# EasyEDA schematic SCH FC.json
TITLE: Sheet_1; REV: 1.0; Date: 2025-05-10; Sheet: 1/1; Drawn By: upkiratpaul; Company: Your Company
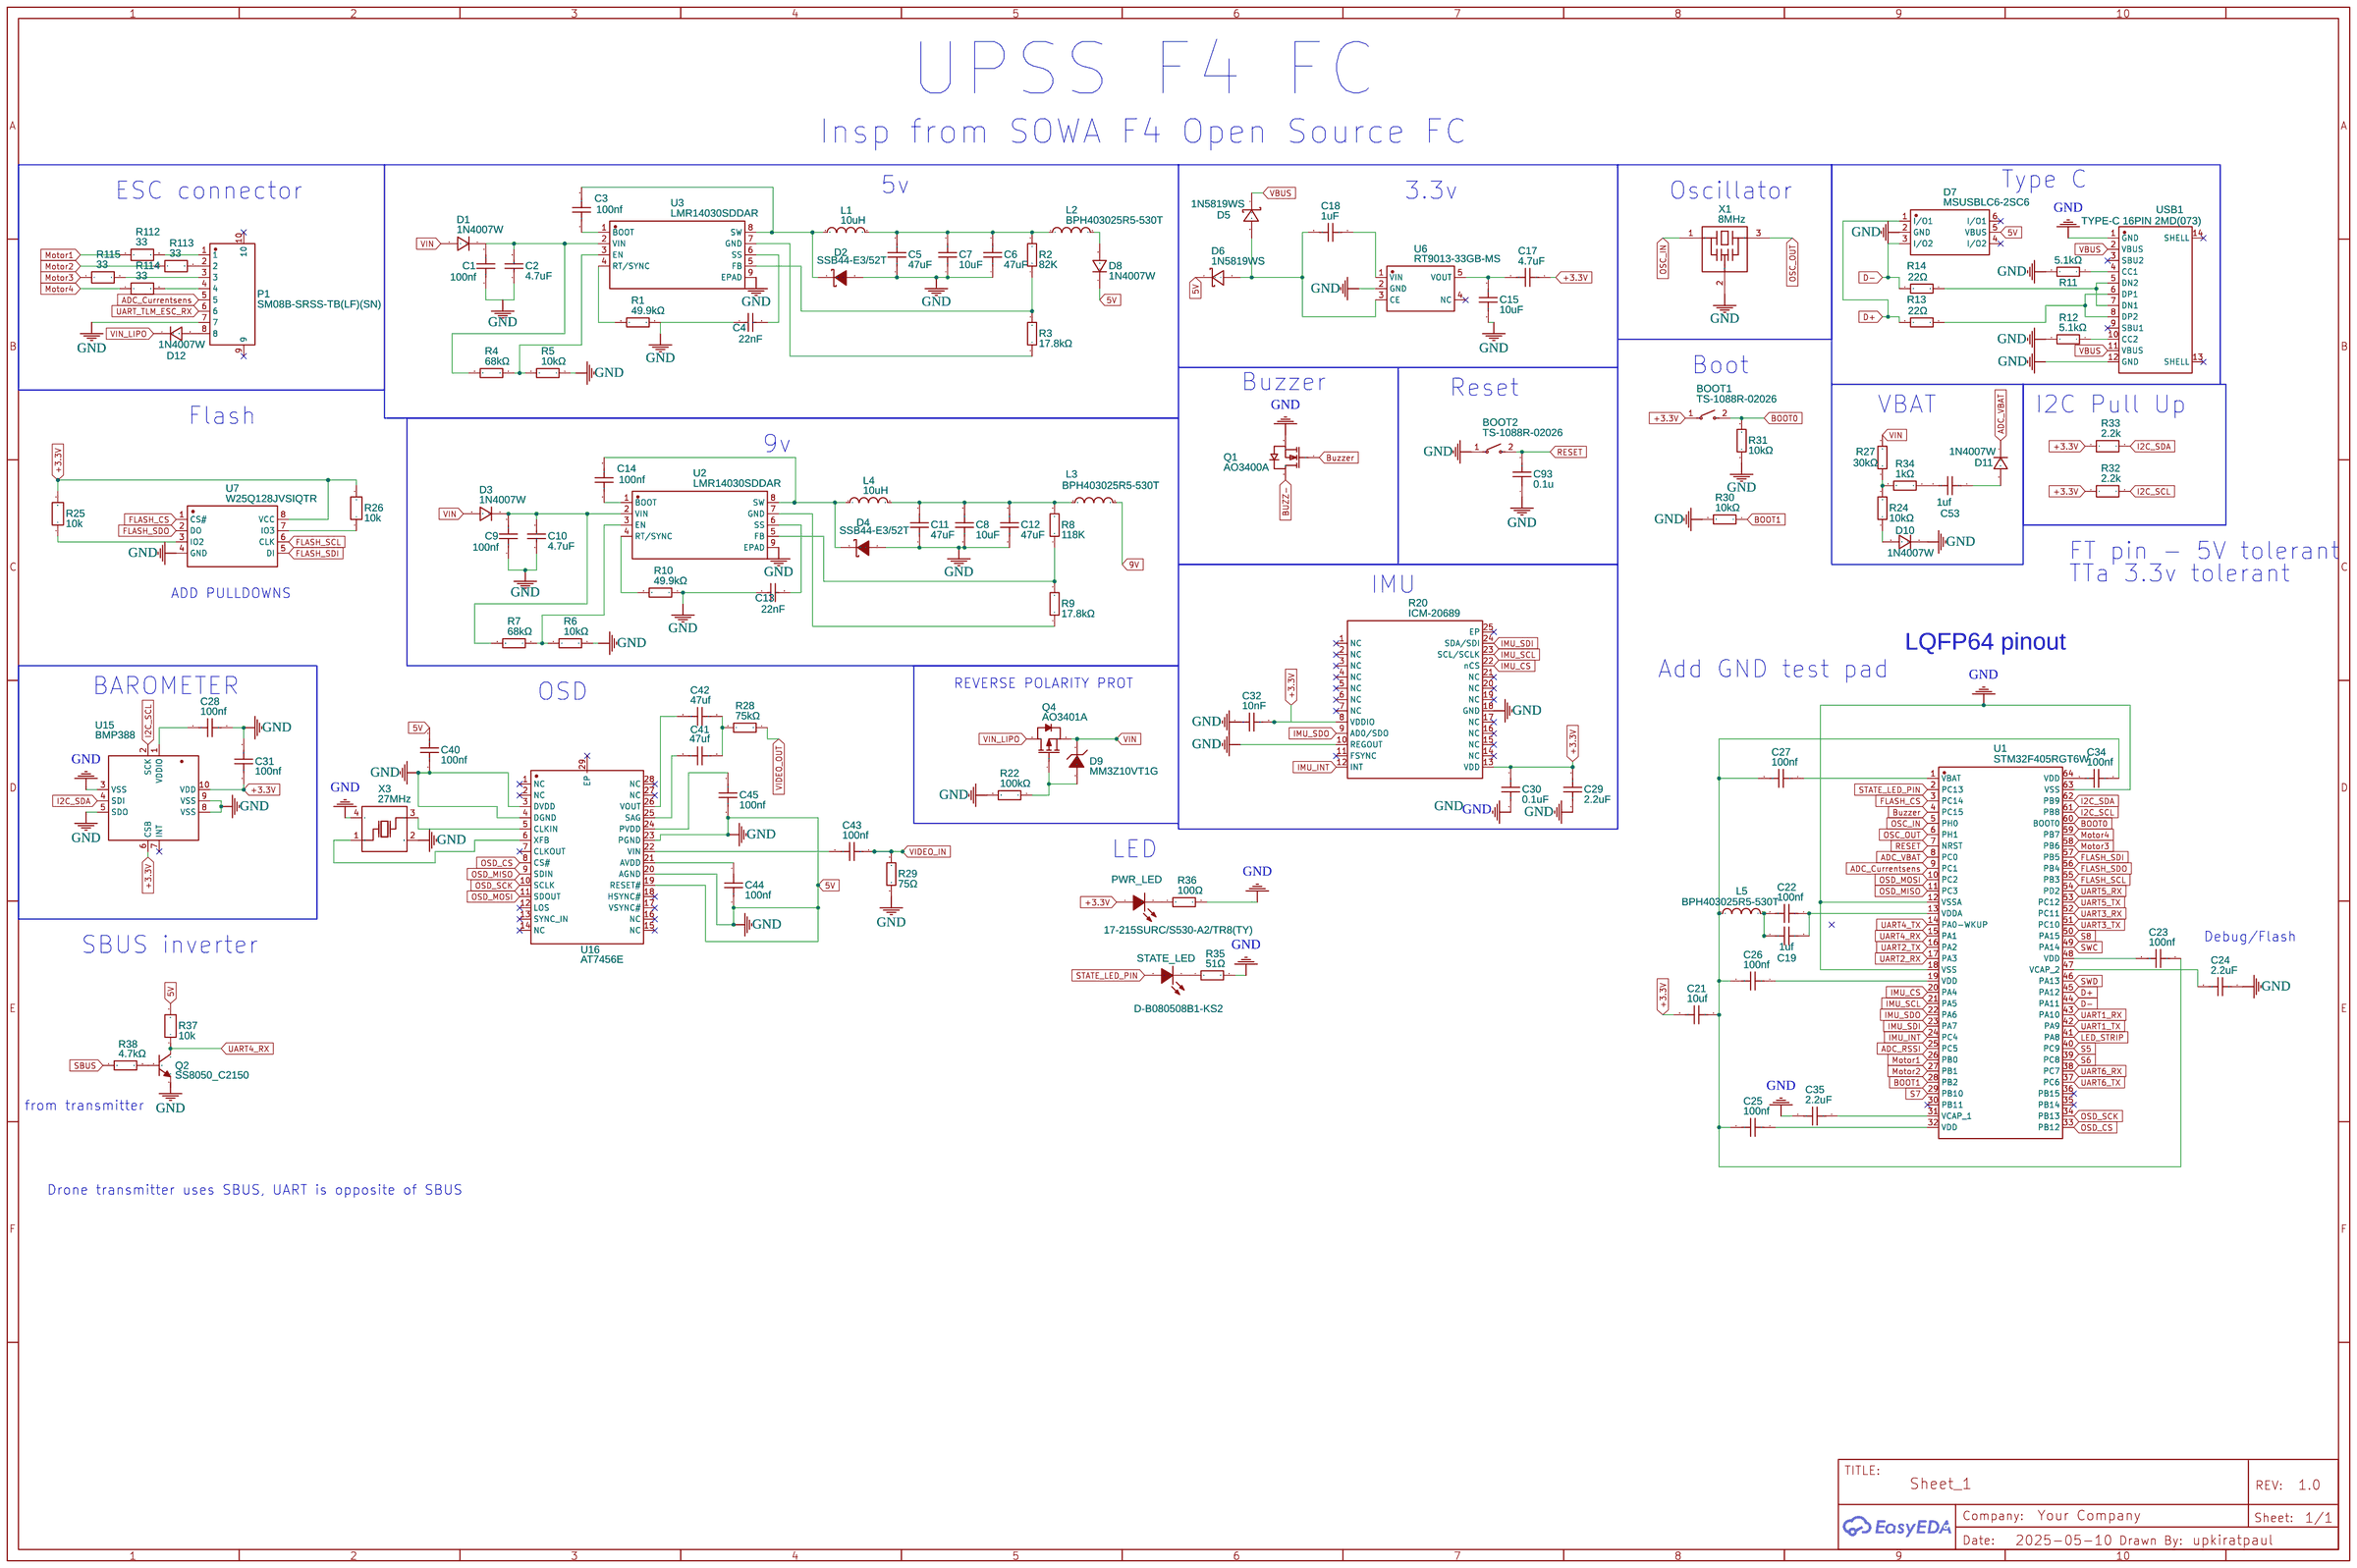
[diagram p0: schematic sheet]

## Parts
BOOT1  TS-1088R-02026  [SW-SMD_L3.9-W3.0-P4.45]
BOOT2  TS-1088R-02026  [SW-SMD_L3.9-W3.0-P4.45]
C1  100nf  [C0603]
C2  4.7uF  [C0805]
C3  100nf  [C0603]
C4  22nF  [C0603]
C5  47uF  [C1206]
C6  47uF  [C1206]
C7  10uF  [C1206]
C8  10uF  [C1206]
C9  100nf  [C0603]
C10  4.7uF  [C0805]
C11  47uF  [C1206]
C12  47uF  [C1206]
C13  22nF  [C0603]
C14  100nf  [C0603]
C15  10uF  [C0402]
C17  4.7uF  [C0402]
C18  1uF  [C0402]
C19  1uf  [C0603]
C21  10uf  [C0603]
C22  100nf  [C0603]
C23  100nf  [C0603]
C24  2.2uF  [C0603]
C25  100nf  [C0603]
C26  100nf  [C0603]
C27  100nf  [C0603]
C28  100nf  [C0603]
C29  2.2uF  [C0402]
C30  0.1uF  [C0402]
C31  100nf  [C0603]
C32  10nF  [C0402]
C34  100nf  [C0603]
C35  2.2uF  [C0603]
C40  100nf  [C0603]
C41  47uf  [C0603]
C42  47uf  [C0603]
C43  100nf  [C0603]
C44  100nf  [C0603]
C45  100nf  [C0603]
C53  1uf  [C0603]
C93  0.1u  [C0603]
D1  1N4007W  [SOD-123_L2.8-W1.8-LS3.7-RD]
D2  SSB44-E3/52T  [SMB_L4.3-W3.6-LS5.4-RD]
D3  1N4007W  [SOD-123_L2.8-W1.8-LS3.7-RD]
D4  SSB44-E3/52T  [SMB_L4.3-W3.6-LS5.4-RD]
D5  1N5819WS  [SOD-323_L1.7-W1.3-LS2.5-FD]
D6  1N5819WS  [SOD-323_L1.7-W1.3-LS2.5-FD]
D7  MSUSBLC6-2SC6  [SOT-23-6_L2.9-W1.6-P0.95-LS2.8-BL]
D8  1N4007W  [SOD-123_L2.8-W1.8-LS3.7-RD]
D9  MM3Z10VT1G  [SOD-323_L1.8-W1.3-LS2.5-RD]
D10  1N4007W  [SOD-123_L2.8-W1.8-LS3.7-RD]
D11  1N4007W  [SOD-123_L2.8-W1.8-LS3.7-RD]
D12  1N4007W  [SOD-123_L2.8-W1.8-LS3.7-RD]
L1  10uH  [IND-SMD_L7.3-W6.8]
L2  BPH403025R5-530T  [BEAD-SMD_L4.0-W3.1]
L3  BPH403025R5-530T  [BEAD-SMD_L4.0-W3.1]
L4  10uH  [IND-SMD_L7.3-W6.8]
L5  BPH403025R5-530T  [BEAD-SMD_L4.0-W3.1]
P1  SM08B-SRSS-TB(LF)(SN)  [CONN-TH_SM08B-SRSS-TB-LF-SN]
PWR_LED  17-215SURC/S530-A2/TR8(TY)  [LED0805-RD_RED]
Q1  AO3400A  [SOT-23-3_L2.9-W1.6-P1.90-LS2.8-BR]
Q2  SS8050_C2150  [SOT-23-3_L2.9-W1.3-P1.90-LS2.4-BR]
Q4  AO3401A  [SOT-23_L2.9-W1.3-P1.90-LS2.4-BR]
R1  49.9kΩ  [R0603]
R2  82K  [R0402]
R3  17.8kΩ  [R0603]
R4  68kΩ  [R0603]
R5  10kΩ  [R0603]
R6  10kΩ  [R0603]
R7  68kΩ  [R0603]
R8  118K  [R0402]
R9  17.8kΩ  [R0603]
R10  49.9kΩ  [R0603]
R11  5.1kΩ  [R0603]
R12  5.1kΩ  [R0603]
R13  22Ω  [R0603]
R14  22Ω  [R0603]
R20  ICM-20689  [QFN-24_L4.0-W4.0-P0.50-TL-EP2.6]
R22  100kΩ  [R0603]
R24  10kΩ  [R0603]
R25  10k  [R0402]
R26  10k  [R0402]
R27  30kΩ  [R0603]
R28  75kΩ  [R0603]
R29  75Ω  [R0603]
R30  10kΩ  [R0603]
R31  10kΩ  [R0603]
R32  2.2k  [R0402]
R33  2.2k  [R0402]
R34  1kΩ  [R0603]
R35  51Ω  [R0603]
R36  100Ω  [R0603]
R37  10k  [R0402]
R38  4.7kΩ  [R0402]
R112  33  [R0603]
R113  33  [R0603]
R114  33  [R0603]
R115  33  [R0603]
STATE_LED  D-B080508B1-KS2  [LED0805-RD]
U1  STM32F405RGT6W  [LQFP-64_L10.0-W10.0-P0.50-LS12.0-BL]
U2  LMR14030SDDAR  [SO-8_L4.9-W3.9-P1.27-LS6.0-BL-EP]
U3  LMR14030SDDAR  [SO-8_L4.9-W3.9-P1.27-LS6.0-BL-EP]
U6  RT9013-33GB-MS  [SOT-23-5_L2.9-W1.6-P0.95-LS2.8-BR]
U7  W25Q128JVSIQTR  [SOIC-8_L5.3-W5.3-P1.27-LS8.0-BL]
U15  BMP388  [SENSORM-SMD_BMP388]
U16  AT7456E  [HTSSOP-28_L9.7-W4.4-P0.65-LS6.4-BL]
USB1  TYPE-C 16PIN 2MD(073)  [USB-C-SMD_TYPE-C-6PIN-2MD-073]
X1  8MHz  [OSC-SMD_3P-L3.2-W1.3-P1.2-L]
X3  27MHz  [OSC-SMD_4P-L3.2-W2.5-BL]

## Library data of the parts
BOOT1 BOOT2 = TS-1088R-02026: Contributor: LCSC; Supplier: LCSC; Supplier Part: C455280; Manufacturer: XUNPU(讯普); JLCPCB Part Class: Extended Part
C1 C3 C9 C14 C19 C21-C23 C25-C28 C31 C34 C40-C45 C53 = C_0603_US: Supplier Part: C1591; Supplier: LCSC; Contributor: LCEDA_Lib; Manufacturer Part: CL10B104KB8NNNC; Manufacturer: SAMSUNG(三星)
C2 C10 = CL21A475KBQNNNE: Supplier: LCSC; Manufacturer: SAMSUNG(三星); Supplier Part: C98192; JLCPCB Part Class: Extended Part
C4 C13 = CL10B223KB8NNNC: Supplier: LCSC; Manufacturer: SAMSUNG(三星); Supplier Part: C21122; JLCPCB Part Class: Basic Part
C5-C8 C11 C12 = CL31A476MPHNNNE: Supplier: LCSC; Manufacturer: Murata; Manufacturer Part: GRM31CR61E476ME44L; Supplier Part: C403725
C15 C17 C18 C29 C30 C32 = CGA0805X7R105M500MT: Supplier: LCSC; Supplier Part: C52923; Manufacturer: SAMSUNG(三星); Manufacturer Part: CL05A105KA5NQNC; Contributor: lcsc; JLCPCB Part Class: Extended Part
C24 C35 = C_0603_US: Supplier Part: C23630; Supplier: LCSC; Contributor: LCEDA_Lib; Manufacturer Part: CL10A225KO8NNNC; Manufacturer: SAMSUNG(三星)
C93 = C_0603_US: Contributor: LCEDA_Lib
D1 D3 D8 D10-D12 = 1N4007W: Supplier: LCSC; Supplier Part: C328592; Manufacturer: BLUE ROCKET; Contributor: LCEDA_Lib
D2 D4 = SSB44-E3/52T: Contributor: LCSC; Supplier: LCSC; Supplier Part: C466999; Manufacturer: VISHAY(威世); JLCPCB Part Class: Extended Part
D5 D6 = 1N5819WS: Contributor: LCSC; Supplier: LCSC; Supplier Part: C191023; Manufacturer: Hottech(合科泰); JLCPCB Part Class: Basic Part
D7 = MSUSBLC6-2SC6: Contributor: lcsc; Supplier: LCSC; Supplier Part: C2830148; Manufacturer: MSKSEMI(美森科); JLCPCB Part Class: Extended Part
D9 = MM3Z10VT1G: Supplier: LCSC; Manufacturer: onsemi(安森美); Supplier Part: C39057; JLCPCB Part Class: Extended Part
L1 L4 = FXL0630-100-M: Contributor: LCSC; Supplier: LCSC; Manufacturer: cjiang(长江微电); Supplier Part: C167223; JLCPCB Part Class: Extended Part
L2 L3 L5 = BPH403025R5-530T: Contributor: LCSC; Supplier: LCSC; Supplier Part: C2880047; Manufacturer: TAI-TECH(台庆); JLCPCB Part Class: Extended Part
P1 = SM08B-SRSS-TB(LF)(SN): Contributor: LCSC; Supplier: LCSC; Supplier Part: C160407; Manufacturer: JST; JLCPCB Part Class: Extended Part
PWR_LED = 17-215SURC/S530-A2/TR8(TY): Contributor: LCSC; Supplier: LCSC; Manufacturer: EVERLIGHT(亿光); Manufacturer Part: 17-215SURC/S530-A2/TR8; Supplier Part: C142306; JLCPCB Part Class: Extended Part
Q1 = AO3400A: Supplier: LCSC; Manufacturer: AOS; Supplier Part: C20917; JLCPCB Part Class: Basic Part
Q2 = SS8050_C2150: Supplier: LCSC; Manufacturer: CJ(江苏长电/长晶); Manufacturer Part: SS8050; Supplier Part: C2150; JLCPCB Part Class: Basic Part
Q4 = AO3401A: Supplier: LCSC; Manufacturer: AOS; Supplier Part: C15127; JLCPCB Part Class: Basic Part
R1 R4-R7 R10 = 0603WAF4992T5E: Supplier: LCSC; Manufacturer: UNI-ROYAL(厚声); Supplier Part: C23184; JLCPCB Part Class: Basic Part
R2 R8 = 0402WGF1003TCE: Supplier: LCSC; Manufacturer: UNI-ROYAL; Supplier Part: C25741
R3 R9 R11-R14 = RC0603FR-0717K8L: Contributor: LCSC; Supplier: LCSC; Supplier Part: C185364; Manufacturer: YAGEO(国巨); JLCPCB Part Class: Extended Part
R20 = ICM-20689: Contributor: LCSC; Supplier: LCSC; Supplier Part: C2649494; Manufacturer: TDK InvenSense(应美盛); JLCPCB Part Class: Extended Part
R22 R28 = 0603WAF1003T5E: Supplier: LCSC; Manufacturer: UNI-ROYAL(厚声); Supplier Part: C25803; JLCPCB Part Class: Basic Part
R24 = 0603WAF2001T5E: Supplier: LCSC; Manufacturer: UNI-ROYAL(厚声); Supplier Part: C22975; JLCPCB Part Class: Basic Part
R25 R26 R37 = R_0603_EU: Supplier Part: C25744; Supplier: LCSC; Contributor: LCEDA_Lib; Manufacturer Part: 0402WGF1002TCE; Manufacturer: UNI-ROYAL(厚声)
R27 R34 = 0603WAF1802T5E: Supplier: LCSC; Manufacturer: UNI-ROYAL(厚声); Supplier Part: C25810; JLCPCB Part Class: Basic Part
R29 = 0603WAF750JT5E: Supplier: LCSC; Manufacturer: UNI-ROYAL(厚声); Supplier Part: C4275; JLCPCB Part Class: Basic Part
R30 R31 = 0603WAF1002T5E: Supplier: LCSC; Manufacturer: UNI-ROYAL(厚声); Supplier Part: C25804; JLCPCB Part Class: Basic Part
R32 R33 = R_0603_EU: Supplier Part: C25879; Supplier: LCSC; Contributor: LCEDA_Lib; Manufacturer Part: 0402WGF2201TCE; Manufacturer: UNI-ROYAL(厚声)
R35 = 0603WAJ0510T5E: Supplier: LCSC; Manufacturer: UNI-ROYAL(厚声); Supplier Part: C25246; JLCPCB Part Class: Extended Part
R36 = 0603WAF1000T5E: Supplier: LCSC; Manufacturer: UNI-ROYAL(厚声); Supplier Part: C22775; JLCPCB Part Class: Basic Part
R38 = 0402WGF4701TCE: Supplier: LCSC; Manufacturer: UNI-ROYAL(厚声); Supplier Part: C25900; JLCPCB Part Class: Basic Part
R112-R115 = R_0603_EU: Contributor: LCEDA_Lib
STATE_LED = D-B080508B1-KS2: Contributor: LCSC; Supplier: LCSC; Manufacturer: ARKLED(方舟); Supplier Part: C108412; JLCPCB Part Class: Extended Part
U1 = STM32F405RGT6W: Contributor: LCSC; Supplier: LCSC; Supplier Part: C1338820; Manufacturer: ST(意法半导体); JLCPCB Part Class: Extended Part
U2 U3 = LMR14030SDDAR: Contributor: LCSC; Supplier: LCSC; Supplier Part: C182078; Manufacturer: TI(德州仪器); JLCPCB Part Class: Extended Part
U6 = RT9013-33GB-MS: Contributor: lcsc; Supplier: LCSC; Supplier Part: C7434207; Manufacturer: MSKSEMI(美森科); JLCPCB Part Class: Extended Part
U7 = W25Q128JVSIQTR: Supplier: LCSC; Manufacturer: WINBOND(华邦); Manufacturer Part: W25Q128JVSIQ; Supplier Part: C97521; JLCPCB Part Class: Basic Part
U15 = BMP388: Contributor: LCSC; Supplier: LCSC; Supplier Part: C779278; Manufacturer: Bosch(博世); JLCPCB Part Class: Extended Part
U16 = AT7456E: Supplier: LCSC; Manufacturer: 杭州中科微; Supplier Part: C82351; JLCPCB Part Class: Extended Part
USB1 = TYPE-C 16PIN 2MD(073): Contributor: LCSC; Supplier: LCSC; Supplier Part: C2765186; Manufacturer: SHOU HAN(首韩); JLCPCB Part Class: Extended Part
X1 = CSTCE8M00G55-R0: Supplier: LCSC; Manufacturer: muRata(村田); Supplier Part: C70457; JLCPCB Part Class: Extended Part
X3 = SMD-3225_4P27MHZ12PF10PPM-40&#126;+85℃: Contributor: LCSC; Supplier: LCSC; Supplier Part: C164057; Manufacturer: YJX(雅晶鑫); Manufacturer Part: TAXM27M4RFBCCT2T; JLCPCB Part Class: Extended Part

## Nets
5V: BOOT2.1 C1.1 C2.1 C4.1 C5.1 C6.1 C7.1 C8.1 C9.1 C10.1 C11.1 C12.1 C13.1 C15.1 C24.1 C28.1 C29.2 C30.2 C31.2 C32.1 C35.2 C40.1 C40.2 C44.2 C45.2 C93.1 D2.2(A) D4.2(A) D6.1(K) D7.2(GND) D7.5(VBUS) D8.1 D10.1 P1.7 Q1.2(S) Q2.2(E) R1.1 R5.1 R6.1 R10.1 R11.2 R12.2 R20.10(REGOUT) R20.18(GND) R22.2 R29.1 R30.2 R31.1 R35.2 R36.2 R37.2 U1.12(VSSA) U1.18(VSS) U1.63(VSS) U2.9(EPAD) U3.9(EPAD) U6.2(GND) U7.4(GND) U15.3(VSS) U15.5(SDO) U15.8(VSS) U15.9(VSS) U16.3(DVDD) U16.4(DGND) U16.19(RESET#) U16.20(AGND) U16.23(PGND) USB1.1(GND) USB1.12(GND) X1.2(VSS) X3.2(GND) X3.4(GND)
9V: L3.2
+3.3V: BOOT1.1 C17.1 C21.2 C29.1 C30.1 C31.1 C32.2 PWR_LED.2(A) R20.8(VDDIO) R20.13(VDD) R25.2 R26.2 R32.1 R33.1 U7.8(VCC) U15.6(CSB) U15.10(VDD)
VBUS: D5.1(K) USB1.2(VBUS) USB1.11(VBUS)
VIN: D1.2 D3.2 D9.1(C) Q4.2(S) R27.2
VIN_LIPO: D12.1 Q4.3(D)
ADC_Currentsens: P1.5 U1.9(PC1)
ADC_RSSI: U1.25(PC5)
ADC_VBAT: D11.1 U1.8(PC0)
BOOT0: BOOT1.2 R31.2 U1.60(BOOT0)
BOOT1: R30.1 U1.28(PB2)
BUZZ-: Q1.3(D)
Buzzer: Q1.1(G) U1.4(PC15)
D+: D7.1(I/O1) R13.2 U1.45(PA12)
D-: D7.3(I/O2) R14.2 U1.44(PA11)
FLASH_CS: U1.3(PC14) U7.1(CS#)
FLASH_SCL: U1.55(PB3) U7.6(CLK)
FLASH_SDI: U1.57(PB5) U7.5(DI)
FLASH_SDO: U1.56(PB4) U7.2(DO)
I2C_SCL: R32.2 U1.61(PB8) U15.2(SCK)
I2C_SDA: R33.2 U1.62(PB9) U15.4(SDI)
IMU_CS: R20.22(nCS) U1.20(PA4)
IMU_INT: R20.12(INT) U1.24(PC4)
IMU_SCL: R20.23(SCL/SCLK) U1.21(PA5)
IMU_SDI: R20.24(SDA/SDI) U1.23(PA7)
IMU_SDO: R20.9(AD0/SDO) U1.22(PA6)
LED_STRIP: U1.41(PA8)
Motor1: R112.1 U1.26(PB0)
Motor2: R113.1 U1.27(PB1)
Motor3: R115.1 U1.58(PB6)
Motor4: R114.1 U1.59(PB7)
OSC_IN: U1.5(PH0) X1.1
OSC_OUT: U1.6(PH1) X1.3
OSD_CS: U1.33(PB12) U16.8(CS#)
OSD_MISO: U1.11(PC3) U16.9(SDIN)
OSD_MOSI: U1.10(PC2) U16.11(SDOUT)
OSD_SCK: U1.34(PB13) U16.10(SCLK)
RESET: BOOT2.2 C93.2 U1.7(NRST)
S5: U1.40(PC9)
S6: U1.39(PC8)
S7: U1.29(PB10)
S8: U1.50(PA15)
SBUS: R38.1
STATE_LED_PIN: STATE_LED.2(A) U1.2(PC13)
SWC: U1.49(PA14)
SWD: U1.46(PA13)
UART1_RX: U1.43(PA10)
UART1_TX: U1.42(PA9)
UART2_RX: U1.17(PA3)
UART2_TX: U1.16(PA2)
UART3_RX: U1.52(PC11)
UART3_TX: U1.51(PC10)
UART4_RX: Q2.3(C) R37.1 U1.15(PA1)
UART4_TX: U1.14(PA0-WKUP)
UART5_RX: U1.54(PD2)
UART5_TX: U1.53(PC12)
UART6_RX: U1.38(PC7)
UART6_TX: U1.37(PC6)
UART_TLM_ESC_RX: P1.6
VIDEO_IN: C43.1 R29.2
VIDEO_OUT: R28.1
Net-(C1-2): C1.2 C2.2 D1.1 R4.2 U3.2(VIN)
Net-(C3-1): C3.1 U3.1(BOOT)
Net-(C3-2): C3.2 D2.1(C) L1.1 U3.8(SW)
Net-(C4-2): C4.2 U3.6(SS)
Net-(C5-2): C5.2 C6.2 C7.2 L1.2 L2.1 R2.2
Net-(C8-2): C8.2 C11.2 C12.2 L3.1 L4.2 R8.2
Net-(C9-2): C9.2 C10.2 D3.1 R7.2 U2.2(VIN)
Net-(C13-2): C13.2 U2.6(SS)
Net-(C14-1): C14.1 U2.1(BOOT)
Net-(C14-2): C14.2 D4.1(C) L4.1 U2.8(SW)
Net-(C15-2): C15.2 C17.2 U6.5(VOUT)
Net-(C18-1): C18.1 U6.1(VIN)
Net-(C18-2): C18.2 D5.2(A) D6.2(A) U6.3(CE)
Net-(C19-1): C19.1 C22.2 L5.2
Net-(C19-2): C19.2 C22.1 U1.13(VDDA)
Net-(C21-1): C21.1 C23.1 C25.2 C26.2 C27.2 C34.1 L5.1
Net-(C23-2): C23.2 U1.48(VDD)
Net-(C24-2): C24.2 U1.47(VCAP_2)
Net-(C25-1): C25.1 U1.32(VDD)
Net-(C26-1): C26.1 U1.19(VDD)
Net-(C27-1): C27.1 U1.1(VBAT)
Net-(C28-2): C28.2 U15.1(VDDIO)
Net-(C34-2): C34.2 U1.64(VDD)
Net-(C35-1): C35.1 U1.31(VCAP_1)
Net-(C41-1): C41.1 C42.1 R28.2
Net-(C41-2): C41.2 U16.25(SAG)
Net-(C42-2): C42.2 U16.26(VOUT)
Net-(C43-2): C43.2 U16.22(VIN)
Net-(C44-1): C44.1 U16.21(AVDD)
Net-(C45-1): C45.1 U16.24(PVDD)
Net-(C53-1): C53.1 D11.2
Net-(C53-2): C53.2 R34.1
Net-(D8-2): D8.2 L2.2
Net-(D9-2): D9.2(A) Q4.1(G) R22.1
Net-(D10-2): D10.2 R24.1
Net-(D12-2): D12.2 P1.8
Net-(P1-1): P1.1 R112.2
Net-(P1-2): P1.2 R113.2
Net-(P1-3): P1.3 R115.2
Net-(P1-4): P1.4 R114.2
Net-(PWR_LED-1): PWR_LED.1(K) R36.1
Net-(Q2-1): Q2.1(B) R38.2
Net-(R1-2): R1.2 U3.4(RT/SYNC)
Net-(R2-1): R2.1 R3.2 U3.5(FB)
Net-(R3-1): R3.1 U3.7(GND)
Net-(R4-1): R4.1 R5.2 U3.3(EN)
Net-(R6-2): R6.2 R7.1 U2.3(EN)
Net-(R8-1): R8.1 R9.2 U2.5(FB)
Net-(R9-1): R9.1 U2.7(GND)
Net-(R10-2): R10.2 U2.4(RT/SYNC)
Net-(R11-1): R11.1 USB1.4(CC1)
Net-(R12-1): R12.1 USB1.10(CC2)
Net-(R13-1): R13.1 USB1.6(DP1) USB1.8(DP2)
Net-(R14-1): R14.1 USB1.5(DN2) USB1.7(DN1)
Net-(R24-2): R24.2 R27.1 R34.2
Net-(R25-1): R25.1 U7.3(IO2)
Net-(R26-1): R26.1 U7.7(IO3)
Net-(R35-1): R35.1 STATE_LED.1(K)
Net-(U16-5): U16.5(CLKIN) X3.3(OSC2)
Net-(U16-6): U16.6(XFB) X3.1(OSC1)

Not connected (* = marked no-connect by the designer): D7 4(I/O2)* 6(I/O1)*; P1 9* 10*; R20 1(NC)* 2(NC)* 3(NC)* 4(NC)* 5(NC)* 6(NC)* 7(NC)* 11(FSYNC)* 14(NC)* 15(NC)* 16(NC)* 17(NC)* 19(NC)* 20(NC)* 21(NC)* 25(EP)*; U1 30(PB11)* 35(PB14)* 36(PB15)*; U6 4(NC)*; U15 7(INT)*; U16 1(NC)* 2(NC)* 7(CLKOUT)* 12(LOS)* 13(SYNC_IN)* 14(NC)* 15(NC)* 16(NC)* 17(VSYNC#)* 18(HSYNC#)* 27(NC)* 28(NC)* 29(EP)*; USB1 3(SBU2)* 9(SBU1)* 13(SHELL)* 14(SHELL)*

## Notes on the sheet
- UPSS F4 FC
- Insp from SOWA F4 Open Source FC
- Type C
- ESC connector
- 5v
- 3.3v
- Oscillator
- Boot
- Buzzer
- Reset
- VBAT
- I2C Pull Up
- Flash
- 9v
- FT pin - 5V tolerant
- TTa 3.3v tolerant
- IMU
- ADD PULLDOWNS
- LQFP64 pinout
- Add GND test pad
- BAROMETER
- REVERSE POLARITY PROT
- OSD
- GND
- LED
- SBUS inverter
- Debug/Flash
- from transmitter
- Drone transmitter uses SBUS, UART is opposite of SBUS
